# EAGLE design IgorPlug (EAGLE 5.12)
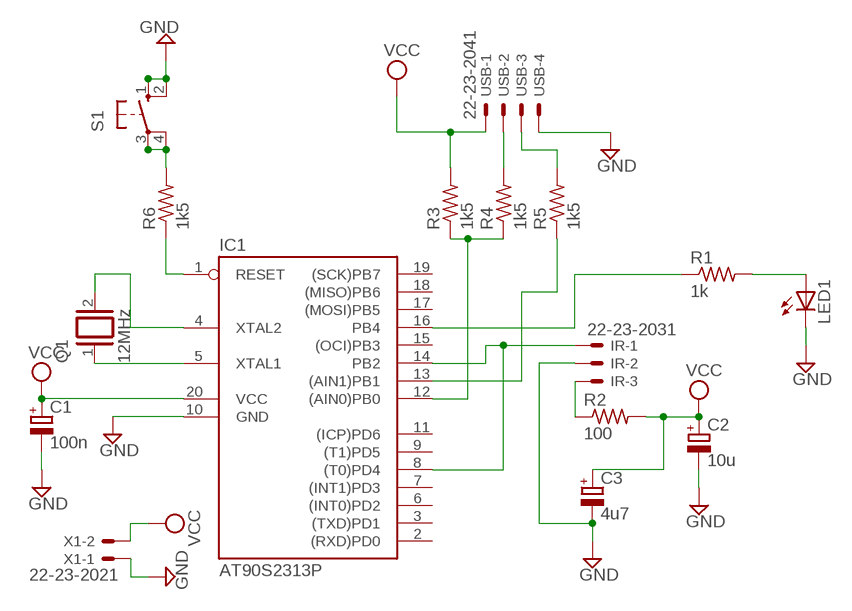
[diagram p0: schematic, sheet 1]

## Parts
C1  100n  CPOL-EUE2.5-6  [E2,5-6]
C2  10u  CPOL-EUE2.5-6  [E2,5-6]
C3  4u7  CPOL-EUE2.5-6  [E2,5-6]
IC1  AT90S2313P  [DIL20]
IR  22-23-2031  [22-23-2031]
LED1  LEDSFH482  [SFH482]
Q1  12MHz  XTAL  [Q]
R1  1k  R-US_0204/5  [0204/5]
R2  100  R-US_0204/5  [0204/5]
R3  1k5  R-US_0204/5  [0204/5]
R4  1k5  R-US_0204/5  [0204/5]
R5  1k5  R-US_0204/5  [0204/5]
R6  1k5  R-US_0204/5  [0204/5]
S1  10-XX  [B3F-10XX]
USB  22-23-2041  [22-23-2041]
X1  22-23-2021  [22-23-2021]

## Nets
GND: C1.- C2.- C3.- IC1.10(GND) IR.2 LED1.K(C) S1.1(S) S1.2(S1) USB.4 X1.1
N$2: IC1.5(XTAL1) Q1.1
N$3: IC1.8((T0)PD4) IC1.14(PB2) IR.1
N$5: IR.3 R2.1
N$6: LED1.A R1.2
N$8: R4.2 USB.2
N$9: R5.2 USB.3
N$10: IC1.12((AIN0)PB0) R3.1 R4.1
N$11: IC1.13((AIN1)PB1) R5.1
N$12: IC1.4(XTAL2) Q1.2
N$13: IC1.16(PB4) R1.1
N$14: IC1.1(RESET) R6.1
N$15: R6.2 S1.3(P) S1.4(P1)
VCC: C1.+ C2.+ C3.+ IC1.20(VCC) R2.2 R3.2 USB.1 X1.2
Unconnected: IC1.2((RXD)PD0) IC1.3((TXD)PD1) IC1.6((INT0)PD2) IC1.7((INT1)PD3) IC1.9((T1)PD5) IC1.11((ICP)PD6) IC1.15((OCI)PB3) IC1.17((MOSI)PB5) IC1.18((MISO)PB6) IC1.19((SCK)PB7)

## Library data of the parts
C1-C3 = rcl:CPOL-EU: POLARIZED CAPACITOR, European symbol
IC1 = atmel:AT90S2313: MICROCONTROLLER 2 Kbytes FLASH 128 bytes SRAM 128 bytes EEPROM UART; OC_FARNELL: unknown; OC_NEWARK: unknown
IR = con-molex:22-23-2031: .100" (2.54mm) Center Header - 3 Pin; MF: MOLEX; MPN: 22-23-2031; OC_FARNELL: 1462950; OC_NEWARK: 30C0862
LED1 = led:LED: LED OSRAM: - CHIPLED LG R971, LG N971, LY N971, LG Q971, LY Q971, LO R971, LY R971 LH N974, LH R974 LS Q976, LO Q976, LY Q976 LO Q996 - Hyper CHIPLED LW Q18S LB Q993, LB Q99A, LB R99A - SideLED LS A670, LO A670, LY A670, LG A670, LP A670 LB A673, LV A673, LT A673, LW A673 LH A674 LY A675 LS A676, LA A676, LO A676, LY A676, LW A676 LS A679, LY A679, LG A679 - Hyper Micro SIDELED® LS Y876, LA Y876, LO Y876, LY Y876 LT Y87S - SmartLED LW L88C, LW L88S LB L89C, LB L89S, LG L890 LS L89K, LO L89K, LY L89K LS L896, LA L896, LO L896, LY L896 - TOPLED LS T670, LO T670, LY T670, LG T670, LP T670 LSG T670, LSP T670, LSY T670, LOP T670, LYG T670 LG T671, LOG T671, LSG T671 LB T673, LV T673, LT T673, LW T673 LH T674 LS T676, LA T676, LO T676, LY T676, LB T676, LH T676, LSB T676, LW T676 LB T67C, LV T67C, LT T67C, LS T67K, LO T67K, LY T67K, LW E67C LS E67B, LA E67B, LO E67B, LY E67B, LB E67C, LV E67C, LT E67C LW T67C LS T679, LY T679, LG T679 LS T770, LO T770, LY T770, LG T770, LP T770 LB T773, LV T773, LT T773, LW T773 LH T774 LS E675, LA E675, LY E675, LS T675 LS T776, LA T776, LO T776, LY T776, LB T776 LHGB T686 LT T68C, LB T68C - Hyper Mini TOPLED® LB M676 - Mini TOPLED Santana® LG M470 LS M47K, LO M47K, LY M47K Source: http://www.osram.convergy.de LUXEON: - LUMILED® LXK2-PW12-R00, LXK2-PW12-S00, LXK2-PW14-U00, LXK2-PW14-V00 LXK2-PM12-R00, LXK2-PM12-S00, LXK2-PM14-U00 LXK2-PE12-Q00, LXK2-PE12-R00, LXK2-PE12-S00, LXK2-PE14-T00, LXK2-PE14-U00 LXK2-PB12-K00, LXK2-PB12-L00, LXK2-PB12-M00, LXK2-PB14-N00, LXK2-PB14-P00, LXK2-PB14-Q00 LXK2-PR12-L00, LXK2-PR12-M00, LXK2-PR14-Q00, LXK2-PR14-R00 LXK2-PD12-Q00, LXK2-PD12-R00, LXK2-PD12-S00 LXK2-PH12-R00, LXK2-PH12-S00 LXK2-PL12-P00, LXK2-PL12-Q00, LXK2-PL12-R00 Source: www.luxeon.com KINGBRIGHT: KA-3528ASYC Source: www.kingbright.com
Q1 = special:XTAL: CRYSTAL
R1-R6 = rcl:R-US_: RESISTOR, American symbol
S1 = switch-omron:10-XX: OMRON SWITCH; MPN: B3F-1000; OC_FARNELL: 176432; OC_NEWARK: 36M3542
USB = con-molex:22-23-2041: .100" (2.54mm) Center Header - 4 Pin; MF: MOLEX; MPN: 22-23-2041; OC_FARNELL: 1462920; OC_NEWARK: 38C0355
X1 = con-molex:22-23-2021: .100" (2.54mm) Center Header - 2 Pin; MF: MOLEX; MPN: 22-23-2021; OC_FARNELL: 1462926; OC_NEWARK: 25C3832

## Board
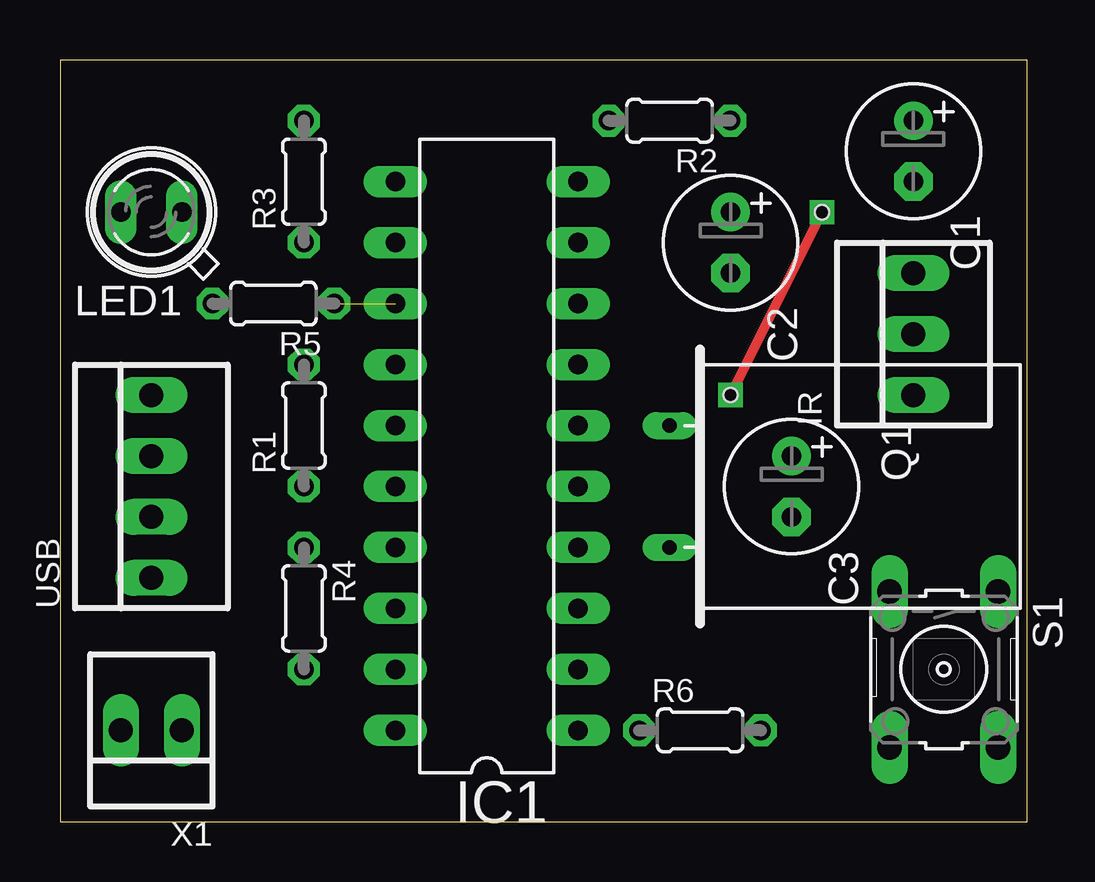
[diagram p1: board, top side]
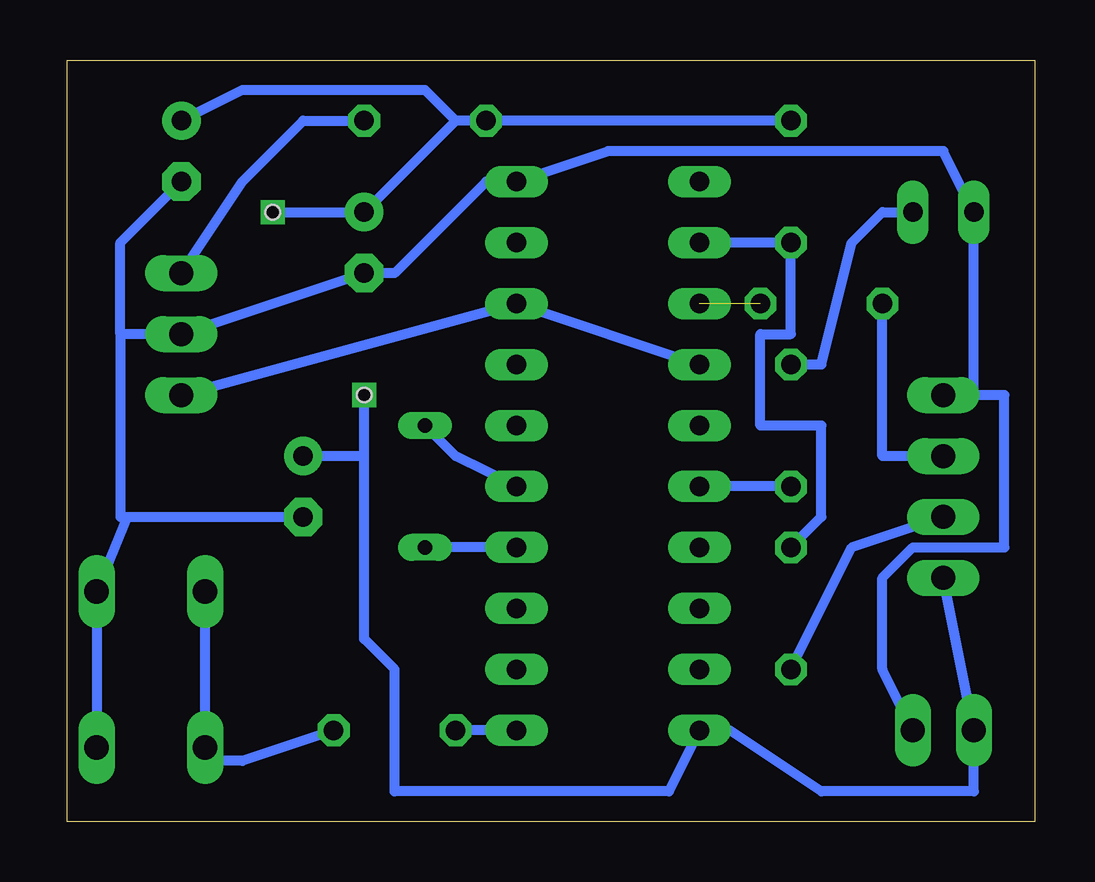
[diagram p2: board, bottom side, seen from below]

Size 40.31 x 31.74 mm. Coordinates in mm from the lower left corner, seen from the top.
Outline: 0,0 40.31,0 40.31,31.74 0,31.74 0,0
Copper layers (1*16): Top 0.035mm / dielectric 1.5mm / Bottom 0.035mm
Design rules "default": minimum track width 10mil, minimum drill 24mil, track to track 8mil, track to pad 8mil, pad to pad 8mil, via to via 8mil, smd to smd 8mil, copper to edge 40mil, drill to drill 8mil, minimum pad ring 10mil, minimum via ring 8mil, stop-mask expansion 4mil, vias tented up to drill 0mil, thermal gap 10mil
Holes 0.6 mm at 31.75,25.4 27.94,17.78

### Footprints (pad centres in the part's own frame; a part is rotated, then mirrored left to right if it is on the bottom)
E2,5-6 = drill 0.813 pad 1.6 round: + -1.27,0 | drill 0.813 pad 1.6 octagon: - 1.27,0
DIL20 = drill 0.813 long: 1 -11.43,-3.81; 2 -8.89,-3.81; 3 -6.35,-3.81; 4 -3.81,-3.81; 5 -1.27,-3.81; 6 1.27,-3.81; 7 3.81,-3.81; 8 6.35,-3.81; 9 8.89,-3.81; 10 11.43,-3.81; 11 11.43,3.81; 12 8.89,3.81; 13 6.35,3.81; 14 3.81,3.81; 15 1.27,3.81; 16 -1.27,3.81; 17 -3.81,3.81; 18 -6.35,3.81; 19 -8.89,3.81; 20 -11.43,3.81
22-23-2031 = drill 1 long: 1 -2.54,0; 2 0,0; 3 2.54,0
SFH482 = drill 0.813 long: A -1.27,0; K 1.27,0
Q = drill 0.61 long: 1 -2.54,-7.62; 2 2.54,-7.62
0204/5 = drill 0.813 octagon: 1 -2.54,0; 2 2.54,0
B3F-10XX = drill 1.016 long: 1 -3.251,2.261; 2 3.251,2.261; 3 -3.251,-2.261; 4 3.251,-2.261
22-23-2041 = drill 1 long: 1 -3.81,0; 2 -1.27,0; 3 1.27,0; 4 3.81,0
22-23-2021 = drill 1 long: 1 -1.27,0; 2 1.27,0

### Placement (x,y rotation side)
C1  35.56,27.94 270 top
C2  27.94,24.13 270 top
C3  30.48,13.97 270 top
IC1  17.78,15.24 90 top
IR  35.56,20.32 90 top
LED1  3.81,25.4 180 top
Q1  33.02,13.97 270 top
R1  10.16,16.51 90 top
R2  25.4,29.21 180 top
R3  10.16,26.67 90 top
R4  10.16,8.89 270 top
R5  8.89,21.59 180 top
R6  26.67,3.81 0 top
S1  36.83,6.35 270 top
USB  3.81,13.97 90 top
X1  3.81,3.81 180 top

### Tracks (layer width: path | path; a pad name or v marks a point on that pad's centre or on a via)
GND
  Bottom 0.406: S1.2 S1.1 37.82,12.7 | 37.82,12.7 38.1,12.7 38.1,20.32 | 37.82,12.7 C3.- | C1.- 38.1,24.13 38.1,20.32 | 38.1,20.32 IR.2 C2.- 26.67,22.86 22.86,26.67 IC1.10 17.78,27.94 3.81,27.94 LED1.K 2.54,17.78 USB.4 1.27,17.78 1.27,11.43 5.08,11.43 6.35,10.16 6.35,6.35 X1.1
N$2
  Bottom 0.406: IC1.5 24.13,15.24 Q1.1
N$3
  Bottom 0.406: IC1.14 IC1.8 IR.1
N$5
  Bottom 0.406: IR.3 33.02,26.67 30.48,29.21 R2.1
N$6
  Bottom 0.406: LED1.A 6.35,25.4 7.62,24.13 8.89,19.05 R1.2
N$8
  Bottom 0.406: R4.2 7.62,11.43 USB.2
N$9
  Bottom 0.406: USB.3 6.35,15.24 R5.2
N$10
  Bottom 0.406: IC1.12 R3.1 10.16,20.32 11.43,20.32 11.43,16.51 8.89,16.51 8.89,12.7 R4.1
N$11  (1 unrouted)
N$12
  Bottom 0.406: IC1.4 Q1.2
N$13
  Bottom 0.406: R1.1 IC1.16
N$14
  Bottom 0.406: IC1.1 R6.1
N$15
  Bottom 0.406: R6.2 33.02,2.54 34.57,2.54 S1.4 S1.3
VCC  (via drill 0.6)
  Top 0.406: v27.94,17.78 v31.75,25.4
  Bottom 0.406: 24.13,29.21 C2.+ v31.75,25.4 | 24.13,29.21 R2.2 R3.2 | 27.94,15.24 C3.+ | 27.94,15.24 27.94,7.62 26.67,6.35 26.67,1.27 15.24,1.27 IC1.20 12.7,3.81 8.89,1.27 2.54,1.27 X1.2 USB.1 | C1.+ 33.02,30.48 25.4,30.48 24.13,29.21 | 27.94,15.24 v27.94,17.78